# EAGLE board happyboardDIP2battery2 (EAGLE 5.06), part 1 of 2
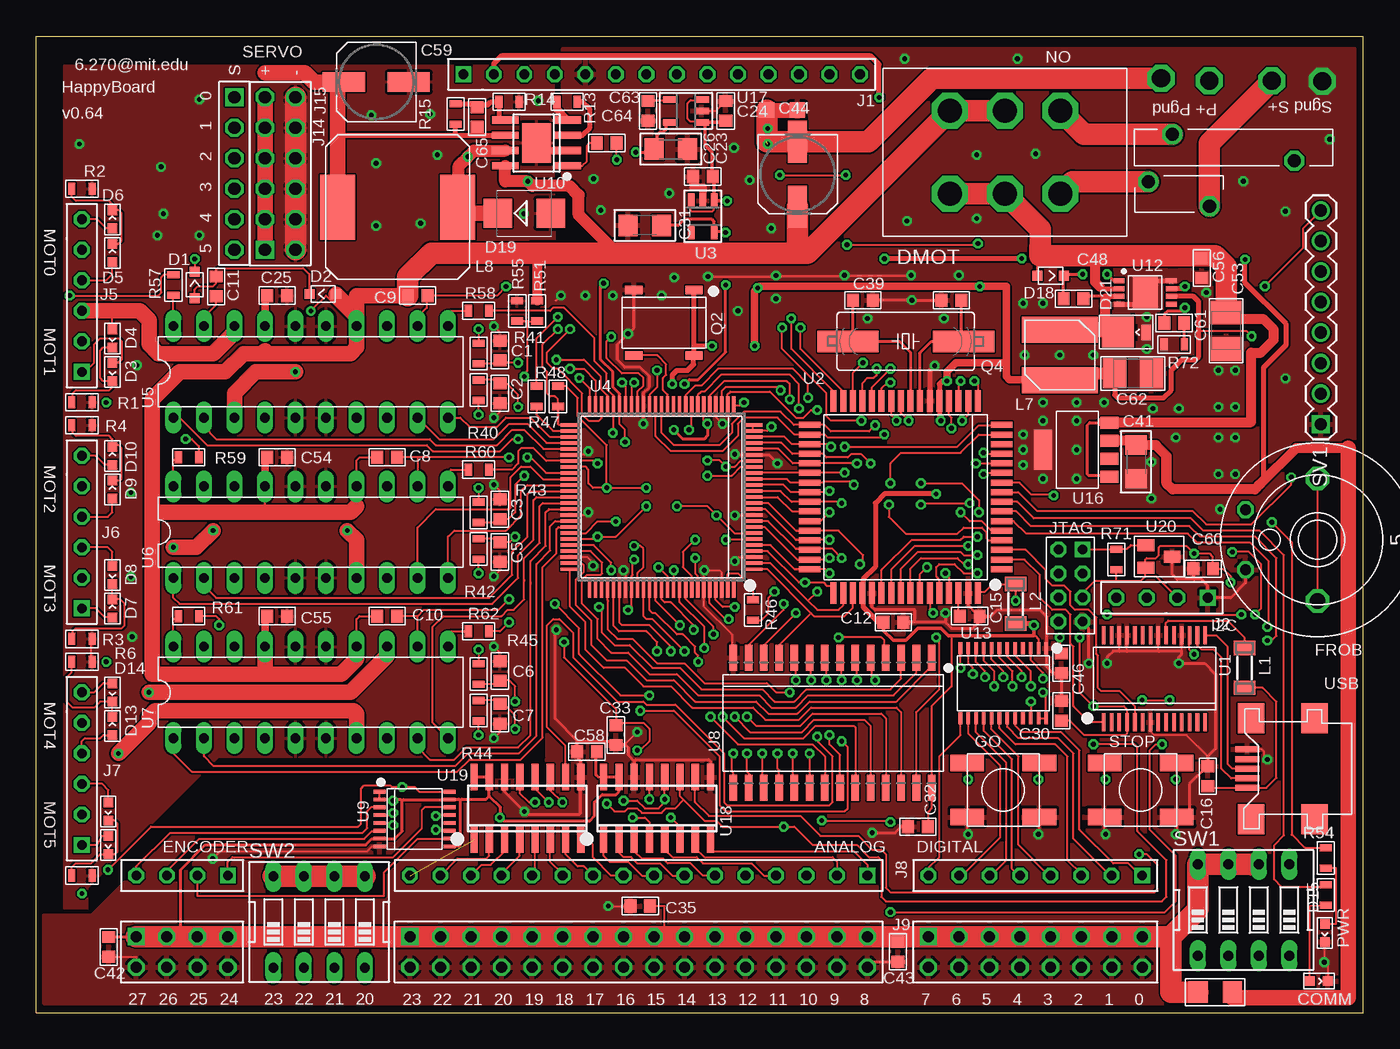
[diagram p6: board, top side]
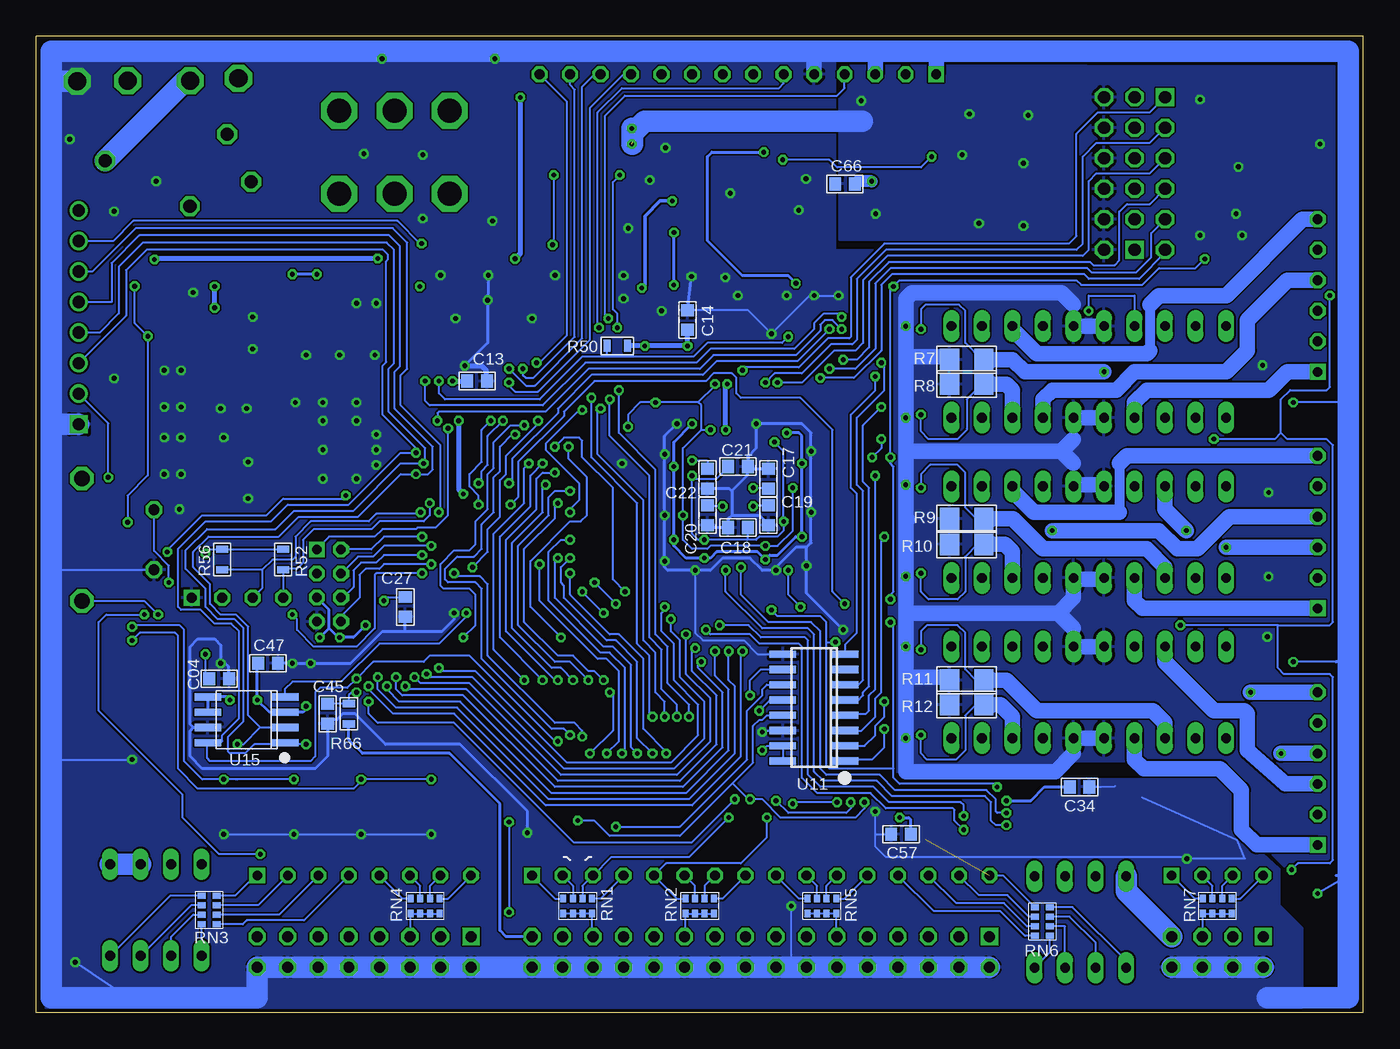
[diagram p7: board, bottom side, seen from below]

Size 110.49 x 81.28 mm. Coordinates in mm from the lower left corner, seen from the top.
Outline: 0,0 0,81.28 110.49,81.28 110.49,0 0,0
Copper layers (1*16): hide 0.035mm / dielectric 1.5mm / Bottom 0.035mm
Design rules "4pcb": minimum track width 6mil, minimum drill 15mil, track to track 6mil, track to pad 6mil, pad to pad 6mil, via to via 6mil, smd to smd 6mil, copper to edge 6mil, drill to drill 6mil, minimum pad ring 10mil, minimum via ring 8mil, stop-mask expansion 4mil, vias tented up to drill 0mil, thermal gap 10mil

## Footprints (pad centres in the part's own frame; a part is rotated, then mirrored left to right if it is on the bottom)
C0603 = smd 0.991 x 1.092: 1 -0.824,0; 2 0.824,0
C1206 = smd 1.6 x 1.8: 1 -1.4,0; 2 1.4,0
153CLV-0605 = smd 3.5 x 1.6: + 2.7,0; - -2.7,0
B/3528-21R = smd 1.95 x 2.5: + 1.525,0; - -1.525,0
SOD323 = smd 0.813 x 0.813: A 1.1,0; C -1.1,0
CHIP-LED0603 = smd 0.8 x 0.8: A 0,-0.75; C 0,0.75
SMB = smd 2.4 x 2.4: A 2.2,0; C -2.2,0
DO216 = smd 0.762 x 1.27: A 0.838,-0.025 | smd 2.667 x 2.54: C -1.524,0
FE14 = drill 0.813 square: 1 -17.78,0 | drill 0.813 octagon: 2 -15.24,0; 3 -12.7,0; 4 -10.16,0; 5 -7.62,0; 6 -5.08,0; 7 -2.54,0; 8 0,0; 9 2.54,0; 10 5.08,0; 11 7.62,0; 12 10.16,0; 13 12.7,0; 14 15.24,0
FE04-1 = drill 0.813 square: 1 -3.81,0 | drill 0.813 octagon: 2 -1.27,0; 3 1.27,0; 4 3.81,0
A3C-8DA = drill 0.8 square: 1 -3,1 | drill 0.8 octagon: 2 -3,-1; 3 -1,1; 4 -1,-1; 5 1,1; 6 1,-1; 7 3,1; 8 3,-1
FE06 = drill 0.813 square: 1 -6.35,0 | drill 0.813 octagon: 2 -3.81,0; 3 -1.27,0; 4 1.27,0; 5 3.81,0; 6 6.35,0
FE08 = drill 0.813 square: 1 -8.89,0 | drill 0.813 octagon: 2 -6.35,0; 3 -3.81,0; 4 -1.27,0; 5 1.27,0; 6 3.81,0; 7 6.35,0; 8 8.89,0
FE08-2 = drill 0.914 square: 1 -8.89,1.27 | drill 0.914 octagon: 2 -8.89,-1.27; 3 -6.35,1.27; 4 -6.35,-1.27; 5 -3.81,1.27; 6 -3.81,-1.27; 7 -1.27,1.27; 8 -1.27,-1.27; 9 1.27,1.27; 10 1.27,-1.27; 11 3.81,1.27; 12 3.81,-1.27; 13 6.35,1.27; 14 6.35,-1.27; 15 8.89,1.27; 16 8.89,-1.27
FE16-1 = drill 0.813 square: 1 -19.05,0 | drill 0.813 octagon: 2 -16.51,0; 3 -13.97,0; 4 -11.43,0; 5 -8.89,0; 6 -6.35,0; 7 -3.81,0; 8 -1.27,0; 9 1.27,0; 10 3.81,0; 11 6.35,0; 12 8.89,0; 13 11.43,0; 14 13.97,0; 15 16.51,0; 16 19.05,0
FE16-2 = drill 0.914 square: 1 -19.05,1.27 | drill 0.914 octagon: 2 -19.05,-1.27; 3 -16.51,1.27; 4 -16.51,-1.27; 5 -13.97,1.27; 6 -13.97,-1.27; 7 -11.43,1.27; 8 -11.43,-1.27; 9 -8.89,1.27; 10 -8.89,-1.27; 11 -6.35,1.27; 12 -6.35,-1.27; 13 -3.81,1.27; 14 -3.81,-1.27; 15 -1.27,1.27; 16 -1.27,-1.27; 17 1.27,1.27; 18 1.27,-1.27; 19 3.81,1.27; 20 3.81,-1.27; 21 6.35,1.27; 22 6.35,-1.27; 23 8.89,1.27; 24 8.89,-1.27; 25 11.43,1.27; 26 11.43,-1.27; 27 13.97,1.27; 28 13.97,-1.27; 29 16.51,1.27; 30 16.51,-1.27; 31 19.05,1.27; 32 19.05,-1.27
FE04-2 = drill 0.914 square: 1 -5.08,1.27 | drill 0.914 octagon: 2 -5.08,-1.27; 3 -2.54,1.27; 4 -2.54,-1.27; 5 0,1.27; 6 0,-1.27; 7 2.54,1.27; 8 2.54,-1.27
MA06-1 = drill 1.016 square: 1 -6.35,0 | drill 1.016 octagon: 2 -3.81,0; 3 -1.27,0; 4 1.27,0; 5 3.81,0; 6 6.35,0
MA06-2 = drill 1.016 octagon: 1 -6.35,-1.27; 3 -3.81,-1.27; 4 -3.81,1.27; 5 -1.27,-1.27; 6 -1.27,1.27; 7 1.27,-1.27; 8 1.27,1.27; 9 3.81,-1.27; 10 3.81,1.27; 11 6.35,-1.27; 12 6.35,1.27 | drill 1.016 square: 2 -6.35,1.27
UX60A-MB-5SY = smd 0.5 x 2: 1 -1.6,2.3; 2 -0.8,2.3; 3 0,2.3; 4 0.8,2.3; 5 1.6,2.3 | smd 2.5 x 2.2: C1 -4.2,2; C2 -4.2,-3.3; C3 4.2,-3.3; C4 4.2,2
SM-1206 = smd 1.2 x 1.8: 1 -1.65,0; 2 1.65,0
R1206 = smd 1.6 x 1.803: 1 -1.422,0; 2 1.422,0
CDRH5D18 = smd 2.15 x 6.3: P$1 2.1,0; P$2 -2.1,0
CDRH127 = smd 5.4 x 2.9: P$1 0,5; P$2 0,-5
CITIZEN-CRYSTAL = smd 1.422 x 0.711: 1 -2.81,-2.767; 2 2.19,-2.767; 3 2.19,2.687; 4 -2.81,2.687
SM49 = smd 5.08 x 1.778: 1 -4.826,0; 2 4.826,0
R0603 = smd 0.6 x 1: 1 -0.85,0; 2 0.85,0
0603-ARC = smd 0.5 x 0.65: 1 -1.2,-0.625; 2 -0.4,-0.625; 3 0.4,-0.625; 4 1.2,-0.625; 5 1.2,0.625; 6 0.4,0.625; 7 -0.4,0.625; 8 -1.2,0.625
TL3301 = smd 2.794 x 1.397: P$1 -3,-2.25; P$2 3,-2.25; P$3 3,2.25; P$4 -3,2.25
1X08 = drill 1.016 square: 1 0,0 | drill 1.016 round: 2 2.54,0; 3 5.08,0; 4 7.62,0; 5 10.16,0; 6 12.7,0; 7 15.24,0; 8 17.78,0
EDG-04 = drill 0.813 long: 1 -3.81,-3.81; 2 -1.27,-3.81; 3 1.27,-3.81; 4 3.81,-3.81; 5 3.81,3.81; 6 1.27,3.81; 7 -1.27,3.81; 8 -3.81,3.81
SSOP-28 = smd 0.3 x 1.5: 1 -4.225,-3.625; 2 -3.575,-3.625; 3 -2.925,-3.625; 4 -2.275,-3.625; 5 -1.625,-3.625; 6 -0.975,-3.625; 7 -0.325,-3.625; 8 0.325,-3.625; 9 0.975,-3.625; 10 1.625,-3.625; 11 2.275,-3.625; 12 2.925,-3.625; 13 3.575,-3.625; 14 4.225,-3.625; 15 4.225,3.625; 16 3.575,3.625; 17 2.925,3.625; 18 2.275,3.625; 19 1.625,3.625; 20 0.975,3.625; 21 0.325,3.625; 22 -0.325,3.625; 23 -0.975,3.625; 24 -1.625,3.625; 25 -2.275,3.625; 26 -2.925,3.625; 27 -3.575,3.625; 28 -4.225,3.625
TQFP64 = smd 0.5 x 1.8: 1 -6,-8; 2 -5.2,-8; 3 -4.4,-8; 4 -3.6,-8; 5 -2.8,-8; 6 -2,-8; 7 -1.2,-8; 8 -0.4,-8; 9 0.4,-8; 10 1.2,-8; 11 2,-8; 12 2.8,-8; 13 3.6,-8; 14 4.4,-8; 15 5.2,-8; 16 6,-8; 33 6,8; 34 5.2,8; 35 4.4,8; 36 3.6,8; 37 2.8,8; 38 2,8; 39 1.2,8; 40 0.4,8; 41 -0.4,8; 42 -1.2,8; 43 -2,8; 44 -2.8,8; 45 -3.6,8; 46 -4.4,8; 47 -5.2,8; 48 -6,8 | smd 1.8 x 0.5: 17 8,-6; 18 8,-5.2; 19 8,-4.4; 20 8,-3.6; 21 8,-2.8; 22 8,-2; 23 8,-1.2; 24 8,-0.4; 25 8,0.4; 26 8,1.2; 27 8,2; 28 8,2.8; 29 8,3.6; 30 8,4.4; 31 8,5.2; 32 8,6; 49 -8,6; 50 -8,5.2; 51 -8,4.4; 52 -8,3.6; 53 -8,2.8; 54 -8,2; 55 -8,1.2; 56 -8,0.4; 57 -8,-0.4; 58 -8,-1.2; 59 -8,-2; 60 -8,-2.8; 61 -8,-3.6; 62 -8,-4.4; 63 -8,-5.2; 64 -8,-6
SOT23-5 = smd 0.55 x 1.2: 1 -0.95,-1.3; 2 0,-1.3; 3 0.95,-1.3; 4 0.95,1.3; 5 -0.95,1.3
VQ100 = smd 0.27 x 1.6: 1 -6,-7.6; 2 -5.5,-7.6; 3 -5,-7.6; 4 -4.5,-7.6; 5 -4,-7.6; 6 -3.5,-7.6; 7 -3,-7.6; 8 -2.5,-7.6; 9 -2,-7.6; 10 -1.5,-7.6; 11 -1,-7.6; 12 -0.5,-7.6; 13 0,-7.6; 14 0.5,-7.6; 15 1,-7.6; 16 1.5,-7.6; 17 2,-7.6; 18 2.5,-7.6; 19 3,-7.6; 20 3.5,-7.6; 21 4,-7.6; 22 4.5,-7.6; 23 5,-7.6; 24 5.5,-7.6; 25 6,-7.6; 51 6,7.6; 52 5.5,7.6; 53 5,7.6; 54 4.5,7.6; 55 4,7.6; 56 3.5,7.6; 57 3,7.6; 58 2.5,7.6; 59 2,7.6; 60 1.5,7.6; 61 1,7.6; 62 0.5,7.6; 63 0,7.6; 64 -0.5,7.6; 65 -1,7.6; 66 -1.5,7.6; 67 -2,7.6; 68 -2.5,7.6; 69 -3,7.6; 70 -3.5,7.6; 71 -4,7.6; 72 -4.5,7.6; 73 -5,7.6; 74 -5.5,7.6; 75 -6,7.6 | smd 1.6 x 0.27: 26 7.6,-6; 27 7.6,-5.5; 28 7.6,-5; 29 7.6,-4.5; 30 7.6,-4; 31 7.6,-3.5; 32 7.6,-3; 33 7.6,-2.5; 34 7.6,-2; 35 7.6,-1.5; 36 7.6,-1; 37 7.6,-0.5; 38 7.6,0; 39 7.6,0.5; 40 7.6,1; 41 7.6,1.5; 42 7.6,2; 43 7.6,2.5; 44 7.6,3; 45 7.6,3.5; 46 7.6,4; 47 7.6,4.5; 48 7.6,5; 49 7.6,5.5; 50 7.6,6; 76 -7.6,6; 77 -7.6,5.5; 78 -7.6,5; 79 -7.6,4.5; 80 -7.6,4; 81 -7.6,3.5; 82 -7.6,3; 83 -7.6,2.5; 84 -7.6,2; 85 -7.6,1.5; 86 -7.6,1; 87 -7.6,0.5; 88 -7.6,0; 89 -7.6,-0.5; 90 -7.6,-1; 91 -7.6,-1.5; 92 -7.6,-2; 93 -7.6,-2.5; 94 -7.6,-3; 95 -7.6,-3.5; 96 -7.6,-4; 97 -7.6,-4.5; 98 -7.6,-5; 99 -7.6,-5.5; 100 -7.6,-6
DIL20 = drill 0.813 long: 1 -11.43,-3.81; 2 -8.89,-3.81; 3 -6.35,-3.81; 4 -3.81,-3.81; 5 -1.27,-3.81; 6 1.27,-3.81; 7 3.81,-3.81; 8 6.35,-3.81; 9 8.89,-3.81; 10 11.43,-3.81; 11 11.43,3.81; 12 8.89,3.81; 13 6.35,3.81; 14 3.81,3.81; 15 1.27,3.81; 16 -1.27,3.81; 17 -3.81,3.81; 18 -6.35,3.81; 19 -8.89,3.81; 20 -11.43,3.81
SOJ28-4 = smd 0.635 x 2.159: 1 -8.255,-5.41; 2 -6.985,-5.41; 3 -5.715,-5.41; 4 -4.445,-5.41; 5 -3.175,-5.41; 6 -1.905,-5.41; 7 -0.635,-5.41; 8 0.635,-5.41; 9 1.905,-5.41; 10 3.175,-5.41; 11 4.445,-5.41; 12 5.715,-5.41; 13 6.985,-5.41; 14 8.255,-5.41; 15 8.255,5.41; 16 6.985,5.41; 17 5.715,5.41; 18 4.445,5.41; 19 3.175,5.41; 20 1.905,5.41; 21 0.635,5.41; 22 -0.635,5.41; 23 -1.905,5.41; 24 -3.175,5.41; 25 -4.445,5.41; 26 -5.715,5.41; 27 -6.985,5.41; 28 -8.255,5.41
TSSOP16 = smd 0.305 x 0.991: 1 -2.275,-2.918; 2 -1.625,-2.918; 3 -0.975,-2.918; 4 -0.325,-2.918; 5 0.325,-2.918; 6 0.975,-2.918; 7 1.625,-2.918; 8 2.275,-2.918; 9 2.275,2.918; 10 1.625,2.918; 11 0.975,2.918; 12 0.325,2.918; 13 -0.325,2.918; 14 -0.975,2.918; 15 -1.625,2.918; 16 -2.275,2.918
SO-08-PAD = smd 0.6 x 2.2: 1 -1.905,-2.6; 2 -0.635,-2.6; 3 0.635,-2.6; 4 1.905,-2.6; 5 1.905,2.6; 6 0.635,2.6; 7 -0.635,2.6; 8 -1.905,2.6 | smd 3.277 x 2.388: P$1 0,0
SO16 = smd 0.6 x 2.2: 1 -4.445,-2.6; 2 -3.175,-2.6; 3 -1.905,-2.6; 4 -0.635,-2.6; 5 0.635,-2.6; 6 1.905,-2.6; 7 3.175,-2.6; 8 4.445,-2.6; 9 4.445,2.6; 10 3.175,2.6; 11 1.905,2.6; 12 0.635,2.6; 13 -0.635,2.6; 14 -1.905,2.6; 15 -3.175,2.6; 16 -4.445,2.6
MSOP8E = smd 0.42 x 0.89: 1 -0.975,-2.177; 2 -0.325,-2.177; 3 0.325,-2.177; 4 0.975,-2.177; 5 0.975,2.177; 6 0.325,2.177; 7 -0.325,2.177; 8 -0.975,2.177 | smd 2.8 x 2.1: PAD 0,0
TSSOP24 = smd 0.305 x 0.991: 1 -3.575,-2.918; 2 -2.925,-2.918; 3 -2.275,-2.918; 4 -1.625,-2.918; 5 -0.975,-2.918; 6 -0.325,-2.918; 7 0.325,-2.918; 8 0.975,-2.918; 9 1.625,-2.918; 10 2.275,-2.918; 11 2.925,-2.918; 12 3.575,-2.918; 13 3.575,2.918; 14 2.925,2.918; 15 2.275,2.918; 16 1.625,2.918; 17 0.975,2.918; 18 0.325,2.918; 19 -0.325,2.918; 20 -0.975,2.918; 21 -1.625,2.918; 22 -2.275,2.918; 23 -2.925,2.918; 24 -3.575,2.918
SO8 = smd 0.6 x 2.2: 1 -1.905,-3.235; 2 -0.635,-3.235; 3 0.635,-3.235; 4 1.905,-3.235; 5 1.905,3.235; 6 0.635,3.235; 7 -0.635,3.235; 8 -1.905,3.235
SOT223-5 = smd 3.3 x 1.5: 1 0,3.454 | smd 1 x 1.5: 2 -2.25,-2.1; 3 -0.75,-2.1; 4 0.75,-2.1; 5 2.25,-2.1
SOT23 = smd 1 x 1.4: 1 -0.95,-1.1; 2 0.95,-1.1; 3 0,1.1
L202021MA04Q = drill 2 octagon: P$1 3.454,4.597; P$2 3.454,0; P$3 3.454,-4.597; P$4 -3.454,4.597; P$5 -3.454,0; P$6 -3.454,-4.597
RUEF090 = drill 1.1 octagon: P$1 -2.54,1.016; P$2 2.54,-1.016
RUEF600 = drill 1.1 octagon: P$2 -5.08,1.105; P$3 5.08,-1.105
FROBKNOB = drill 0.9 octagon: 1 -2.5,-6; 3 2.5,-6 | drill 1.3 octagon: 2A -5.1,0; 2B 5.1,0
GND-GNDA-1,27MM = smd 1.27 x 1.27: GND -1.27,0; GNDA 1.27,0

## Placement (x,y rotation side)
C1  1uF  [C0603]  38.61,55.12 90 top
C2  1uF  [C0603]  38.61,51.56 270 top
C3  1uF  [C0603]  38.61,41.91 90 top
C4  0.1uF  [C0603]  95.25,27.81 0 bottom
C5  1uF  [C0603]  38.61,38.35 270 top
C6  1uF  [C0603]  38.61,28.45 90 top
C7  1uF  [C0603]  38.61,24.89 270 top
C8  0.1uF  [C0603]  29.21,46.23 180 top
C9  0.1uF  [C0603]  31.75,59.69 180 top
C10  0.1uF  [C0603]  29.21,33.02 180 top
C11  33nF  [C0603]  14.99,60.45 270 top
C12  0.1uF  [C0603]  71.37,32.51 0 top
C13  0.1uF  [C0603]  73.79,52.58 0 bottom
C14  0.1uF  [C0603]  56.26,57.66 90 bottom
C15  0.1uF  [C0603]  77.72,33.02 0 top
C16  10nF  [C0603]  97.54,19.68 90 top
C17  0.1uF  [C0603]  49.53,44.45 90 bottom
C18  0.1uF  [C0603]  52.07,40.39 180 bottom
C19  0.1uF  [C0603]  49.53,41.4 270 bottom
C20  0.1uF  [C0603]  54.61,41.4 270 bottom
C21  0.1uF  [C0603]  52.07,45.47 0 bottom
C22  0.1uF  [C0603]  54.61,44.45 270 bottom
C23  0.1uF  [C0603]  55.5,69.6 180 top
C24  0.1uF  [C0603]  57.4,75.06 90 top
C25  0.1uF  [C0603]  20.07,59.69 180 top
C26  2.2uF  [C1206]  52.83,71.88 0 top
C27  0.1uF  [C0603]  79.76,33.78 270 bottom
C30  0.1uF  [C0603]  85.34,25.15 90 top
C31  10uF  [C1206]  50.67,65.53 180 top
C32  0.1uF  [C0603]  73.41,15.49 180 top
C33  0.1uF  [C0603]  48.26,23.11 270 top
C34  0.1uF  [C0603]  23.62,18.8 0 bottom
C35  10nF  [C0603]  50.29,8.89 180 top
C39  18pF  [C0603]  68.83,59.31 0 top
C40  18pF  [C0603]  76.2,59.31 180 top
C41  10uF  [C1206]  91.57,45.85 270 top
C42  0.1uF  [C0603]  6.05,5.49 270 top
C43  0.1uF  [C0603]  71.75,5.08 270 top
C44  220uF  [153CLV-0605]  63.39,69.78 270 top
C45  0.1uF  [C0603]  86.23,24.89 270 bottom
C46  0.1uF  [C0603]  85.34,29.08 270 top
C47  0.1uF  [C0603]  91.19,29.08 0 bottom
C48  0.1uF  [C0603]  86.36,59.44 180 top
C53  10uF  [B/3528-21R]  99.06,56.77 90 top
C54  0.1uF  [C0603]  20.07,46.23 180 top
C55  0.1uF  [C0603]  20.07,33.02 180 top
C56  1uF  [C0603]  97.03,61.98 270 top
C57  0.1uF  [C0603]  38.48,14.86 180 bottom
C58  0.1uF  [C0603]  45.85,21.72 180 top
C59  220uF  [153CLV-0605]  28.32,77.47 180 top
C60  0.1uF  [C0603]  97.16,36.96 180 top
C61  1.5nF  [C0603]  94.74,57.4 0 top
C62  10uF  [B/3528-21R]  91.31,53.21 180 top
C63  1.5nF  [C0603]  50.93,75.06 270 top
C64  10nF  [C0603]  47.5,72.39 0 top
C65  0.22uF  [C0603]  36.7,74.55 90 top
C66  0.22uF  [C0603]  43.15,68.98 180 bottom
D1  1N4148  [SOD323]  13.21,60.58 270 top
D2  1N4148  [SOD323]  23.88,59.82 0 top
D3  GRN  [CHIP-LED0603]  6.35,53.34 180 top
D4  RED  [CHIP-LED0603]  6.35,56.13 180 top
D5  GRN  [CHIP-LED0603]  6.35,63.25 0 top
D6  RED  [CHIP-LED0603]  6.35,66.04 0 top
D7  GRN  [CHIP-LED0603]  6.35,33.66 0 top
D8  RED  [CHIP-LED0603]  6.35,36.45 180 top
D9  GRN  [CHIP-LED0603]  6.35,43.56 0 top
D10  RED  [CHIP-LED0603]  6.35,46.35 0 top
D11  GRN  [CHIP-LED0603]  6.01,13.97 180 top
D12  RED  [CHIP-LED0603]  6.01,16.76 180 top
D13  GRN  [CHIP-LED0603]  6.35,23.88 0 top
D14  RED  [CHIP-LED0603]  6.35,26.67 180 top
D15  GRN  [CHIP-LED0603]  107.28,6.66 180 top
D16  RED  [CHIP-LED0603]  106.78,2.65 270 top
D18  BAT54WS  [SOD323]  84.45,61.34 180 top
D19  SSB44  [SMB]  40.64,66.55 0 top
D21  UPS120  [DO216]  91.57,56.64 0 top
DISP1  16X2LCD  [16X2LCD]  70.36,63.12 180 top
J1  14 Pin Female Header  [FE14]  53.34,78.11 0 top
J2  4 Pin Female Header  [FE04-1]  93.73,34.54 180 top
J4  A3C-8DA  [A3C-8DA]  86.11,35.56 270 top
J5  6x1 Pin Female Header  [FE06]  3.81,59.69 90 top
J6  6x1 Pin Female Header  [FE06]  3.81,40.01 90 top
J7  6x1 Pin Female Header  [FE06]  3.81,20.32 90 top
J8  8x1 Pin Female Header  [FE08]  83.19,11.43 180 top
J9  8x2 Pin Female Header  [FE08-2]  83.19,5.08 0 top
J10  16x1 Pin Female Header  [FE16-1]  50.16,11.43 180 top
J11  16x2 Pin Female Header  [FE16-2]  50.16,5.08 0 top
J12  4x1 Pin Female Header  [FE04-1]  12.15,11.43 180 top
J13  4x2 Pin Female Header  [FE04-2]  13.43,5.08 0 top
J14  6x1 Pin Male Header  [MA06-1]  16.51,69.85 270 top
J15  6x2 Pin Male Header  [MA06-2]  20.32,69.85 90 top
J16  MINIUSB  [UX60A-MB-5SY]  103.12,20.32 90 top
L1  31  [SM-1206]  100.58,28.7 90 top
L2  10uH  [SM-1206]  81.53,34.04 90 top
L3  1uH  [R1206]  98.15,1.72 180 top
L7  5uH  [CDRH5D18]  85.22,54.74 90 top
L8  CDRH127 68uH  [CDRH127]  30.1,67.06 270 top
Q2  8MHz  [CITIZEN-CRYSTAL]  51.94,57.4 180 top
Q4  8MHz  [SM49]  72.39,55.88 180 top
R1  1K  [R0603]  3.81,50.8 180 top
R2  1K  [R0603]  3.81,68.58 180 top
R3  1K  [R0603]  3.81,31.11 180 top
R4  1K  [R0603]  3.81,48.9 180 top
R5  1K  [R0603]  3.81,11.43 180 top
R6  1K  [R0603]  3.81,29.21 180 top
R7  0.2  [R1206]  33.02,54.36 0 bottom
R8  0.2  [R1206]  33.02,52.32 0 bottom
R9  0.2  [R1206]  33.02,41.12 0 bottom
R10  0.2  [R1206]  33.02,38.99 0 bottom
R11  0.2  [R1206]  33.02,27.69 0 bottom
R12  0.2  [R1206]  33.02,25.65 0 bottom
R13  7.68K  [R0603]  44.2,75.82 0 top
R14  1.2K  [R0603]  39.37,75.82 180 top
R15  6.3K  [R0603]  34.92,74.8 90 top
R40  3K  [R0603]  36.83,51.82 270 top
R41  3K  [R0603]  36.83,54.86 90 top
R42  3K  [R0603]  36.83,38.61 270 top
R43  3K  [R0603]  36.83,41.66 90 top
R44  3K  [R0603]  36.83,25.15 270 top
R45  3K  [R0603]  36.83,28.19 90 top
R46  56  [R0603]  59.69,33.53 90 top
R47  56  [R0603]  41.66,51.31 270 top
R48  330  [R0603]  43.43,51.31 90 top
R50  4.7K  [R0603]  62.1,55.5 180 bottom
R51  10K  [R0603]  41.7,58.42 270 top
R52  10K  [R0603]  89.92,37.72 90 bottom
R53  560  [R0603]  107.35,9.8 90 top
R54  560  [R0603]  107.37,12.89 90 top
R55  4.7K  [R0603]  40.06,58.42 90 top
R56  10K  [R0603]  95,37.72 90 bottom
R57  47K  [R0603]  11.43,60.58 270 top
R58  47K  [R0603]  36.83,58.42 180 top
R59  47K  [R0603]  12.7,46.23 180 top
R60  47K  [R0603]  36.83,45.21 180 top
R61  47K  [R0603]  12.7,33.02 180 top
R62  47K  [R0603]  36.83,31.75 180 top
R66  200K  [R0603]  84.45,24.89 270 bottom
R71  10K  [R0603]  89.92,37.72 90 top
R72  4.7K  [R0603]  94.74,55.63 180 top
RN1  47K  [0603-ARC]  65.41,8.89 0 bottom
RN2  47K  [0603-ARC]  55.24,8.89 0 bottom
RN3  47K  [0603-ARC]  96.08,8.56 270 bottom
RN4  47K  [0603-ARC]  78.11,8.89 0 bottom
RN5  47K  [0603-ARC]  45.09,8.89 0 bottom
RN6  47K  [0603-ARC]  26.72,7.61 90 bottom
RN7  47K  [0603-ARC]  12.15,8.89 0 bottom
S2  tact  [TL3301]  80.52,18.54 0 top
S3  tact  [TL3301]  91.95,18.54 0 top
SV1  [1X08]  106.95,48.99 90 top
SW1  [EDG-04]  100.52,8.56 0 top
SW2  [EDG-04]  23.56,7.56 0 top
U1  FT232RL  [SSOP-28]  93.09,27.81 0 top
U2  ATMEGA128L  [TQFP64]  72.39,42.93 90 top
U3  PQ1T251M2ZP  [SOT23-5]  55.5,66.29 180 top
U4  XC3S50  [VQ100]  52.07,42.93 90 top
U5  L6205N  [DIL20]  22.86,53.34 0 top
U6  L6205N  [DIL20]  22.86,40.01 0 top
U7  L6205N  [DIL20]  22.86,26.67 0 top
U8  CY7C199  [SOJ28-4]  66.29,24.13 180 top
U9  CD40109B  [TSSOP16]  31.5,16.13 270 top
U10  A8447  [SO-08-PAD]  41.66,72.39 90 top
U11  MCP3008  [SO16]  45.72,25.4 90 bottom
U12  LT1767EMS8E  [MSOP8E]  92.33,59.94 270 top
U13  GTL2010PW  [TSSOP24]  80.52,27.43 180 top
U15  AT45DB011B  [SO8]  92.96,24.38 90 bottom
U16  LP36890  [SOT223-5]  87.25,46.86 90 top
U17  ADP171X  [SOT23-5]  54.1,75.06 90 top
U18  MCP3008  [SO16]  51.69,17.02 0 top
U19  MCP3008  [SO16]  40.89,17.02 0 top
U20  MCP130T  [SOT23]  93.47,37.97 270 top
U$10  L202021MA04Q  [L202021MA04Q]  80.66,71.61 270 top
U$11  RUEF090  [RUEF090]  95.14,68.15 180 top
U$16  RUEF600  [RUEF600]  99.67,72.01 180 top
VR1  FROBKNOB  [FROBKNOB]  106.68,39.37 270 top
~NUDEV~1  GND-GNDA1,27MM  [GND-GNDA-1,27MM]  62.1,75.13 180 top

## Tracks (layer width: path | path; a pad name or v marks a point on that pad's centre or on a via)
+1.2V  (via drill 0.4)
  hide 0.152: U4.69 45.77,39.93 46.74,40.89 v48.26,40.89 | U4.18 58.63,45.43 57.91,44.7 v55.88,44.7 | U4.45 48.57,48.97 49.02,48.51 v49.02,47.5 | v54.86,39.37 53.85,38.35 53.85,37.08 54.57,36.36 U4.93
  hide 0.254: U4.45 48.57,51.51 48.01,52.07 48.01,53.34 46.99,54.36 46.99,60.45 v47.24,60.71 | 51.53,71.98 C26.1 | 51.56,71.88 51.31,71.63 v49.91,71.63
  hide 0.305: C26.1 51.56,71.88 51.53,71.91 51.69,72.14 51.69,73.03 51.94,73.28 52.2,73.28 52.45,73.53 52.45,74.04 U17.5
  Bottom 0.152: 51.31,39.37 50.55,39.37 50.29,39.62 48.77,39.62 48.26,40.13 v48.26,40.89 48.26,46.74 v49.02,47.5 | 51.31,39.37 v54.86,39.37 55.37,39.37 55.88,39.88 55.88,44.45 | 55.88,44.45 53.85,44.45 52.83,45.47 C21.1 | C18.1 51.25,39.43 51.31,39.37 | 55.88,44.45 v55.88,44.7
  Bottom 0.254: v47.24,60.71 47.88,61.34 51.69,61.34 54.61,64.26 54.61,71.25 54.23,71.63 v49.91,71.63
+2.5V  (via drill 0.4)
  hide 0.152: 59.69,48.93 U4.25 59.67,48.53 59.69,48.51 59.67,48.49 U4.24 60.87,48.43 v61.21,48.77 | U4.26 58.65,50.53 v58.93,50.8 | U4.58 45.76,45.43 45.97,45.21 45.97,44.07 46.35,43.69 v47.5,43.69 | U4.33 54.57,48.73 v54.36,48.51 | U4.7 58.12,39.93 v56.64,41.4 55.88,42.16 v53.34,42.16 | U4.84 50.07,36.61 50.55,37.08 50.55,38.61 50.29,38.86 v49.78,38.86 | v47.5,43.69 v50.8,43.69 | R48.2 44.11,52.16 45.09,51.18 45.09,49.66 47.5,47.24 v47.5,43.69
  hide 0.254: v53.98,52.32 54.36,52.7 55.12,52.7 57.4,54.99 v57.4,60.58 | C31.1 53.47,65.53 53.98,66.04 56.26,66.04 56.45,65.85 U3.5 57.33,64.99 v57.39,64.93
  Bottom 0.152: v61.21,48.77 61.21,49.78 60.2,50.8 v58.93,50.8 55.37,50.8 | 55.12,48.51 v54.36,48.51 | v47.5,43.69 47.5,40.13 48.77,38.86 v49.78,38.86 54.36,38.86 54.61,38.61 55.88,38.61 56.64,39.37 v56.64,41.4 56.64,46.99 55.12,48.51 | 55.12,48.51 55.12,50.55 55.37,50.8 | C17.1 49.53,43.69 v50.8,43.69 | C20.1 54.61,42.16 v53.34,42.16 | 55.37,50.8 53.98,52.2 v53.98,52.32
  Bottom 0.254: v57.4,60.58 v57.39,64.93
+3.3V  (via drill 0.4)
  hide 0.152: v2.79,59.69 10.16,59.69 10.41,59.94 10.41,61.21 10.67,61.47 11.3,61.47 11.34,61.43 R57.1 | v15.24,32.26 15.24,32.77 14.99,33.02 R61.1 | R59.1 13.55,47.16 12.95,47.75 v12.45,47.75 | v46.74,45.72 46.53,45.93 U4.57 42.47,45.93 41.4,46.99 40.39,46.99 40.13,46.74 40.13,45.72 39.62,45.21 R60.1 37.59,45.21 | U4.70 46.43,39.43 v46.74,39.62 48.26,39.62 v50.8,42.16 | U4.94 55.07,36.37 54.86,36.58 v54.86,37.85 | U4.6 57.46,39.43 v57.4,39.37 | U4.19 58.63,45.93 58.17,45.47 v57.4,45.47 56.9,45.97 v55.88,45.97 | v48.01,48.26 48.07,48.32 U4.46 48.07,51.37 47.5,51.94 47.5,53.21 46.48,54.23 46.48,56.13 43.94,58.67 43.05,58.67 42.8,58.42 R58.1 | 68.83,34.8 68.79,34.84 U2.52 68.79,35.01 68.83,35.05 | R62.1 38.61,31.75 v39.37,32.51 | v49.28,33.53 49.57,33.82 U4.83 49.57,36.36 49.66,36.45 49.66,37.59 v49.78,37.72 | U4.31 55.57,49.33 v55.88,49.02 | v83.06,32.26 82.93,32.39 | 75.95,31.37 76.07,31.37 76.2,31.24 76.2,27.18 74.55,25.53 U8.28 74.55,17.02 74.23,16.7 C32.1 | U13.2 83.44,31.11 83.19,31.37 83.06,31.37 | 70.1,32.51 C12.1 | v50.04,21.84 50.29,21.84 51.05,22.61 51.05,23.62 50.55,24.13 48.26,24.13 | 48.26,24.13 C33.1 | 48.26,24.13 48.26,25.27 43.94,29.59 v43.94,30.86 | U9.16 34.41,18.41 34.42,18.41 31.88,18.41 31.5,18.8 v30.48,18.8 29.59,18.8 29.46,18.92 27.3,18.92 27.05,18.67 27.05,15.75 26.8,15.49 9.57,15.49 v5.98,11.91 | J4.5 87.11,34.91 88.14,35.94 89.92,35.94 | 89.92,35.94 91.95,35.94 92.33,36.32 | 89.92,35.94 R71.1 | v92.08,26.04 v94.36,26.04 | v86.87,31.24 86.87,26.67 v88.01,25.53 90.55,25.53 90.82,25.26 U1.4 90.82,24.14 90.81,24.13 90.81,23.24 90.68,23.11 87.25,23.11 86.04,24.32 C30.1
  hide 0.152: v85.22,31.24 85.22,29.97 C46.1 | 92.33,36.32 92.33,36.83 | 92.33,36.83 92.33,36.96 92.37,37 U20.2 92.37,36.87 92.33,36.83 | 54.74,54.61 54.75,54.63 Q2.4 54.74,54.74 54.86,54.74 54.84,54.72 | Q2.1 54.75,60.18 54.74,60.2 | v75.82,52.58 75.44,52.58 | 92.33,36.83 92.33,37.72 92.46,37.85 93.22,37.85 93.47,38.1 93.47,38.73 93.6,38.86 95.76,38.86 v96.39,38.23 97.66,38.23 97.92,37.97 97.92,37.08 97.98,37.02 C60.1 | 55.37,74.17 54.48,74.17 54.23,74.42 54.23,75.69 54.48,75.95 55.5,75.95 | 55.44,76.01 U17.3 | U3.3 54.48,67.72 54.48,66.8 54.61,66.67 56.26,66.67 56.39,66.8 56.39,67.72 U3.1 | v99.44,35.81 99.44,36.32 98.81,36.96 C60.1 | C60.1 97.92,36.96 | 92.33,36.32 93.22,36.32 J2.2 | 104.52,14.85 104.52,14.81 | R54.2 105.63,13.74 104.52,14.85 | 104.52,14.85 104.52,39.16 v102.86,40.82 | 96.77,56.75 100.75,56.75 v101.19,56.31 | v102.28,60.46 105.47,63.65 105.47,65.29 SV1.8
  hide 0.254: v55.88,49.02 55.88,48.01 55.63,47.75 53.85,47.75 v53.09,48.51 | 57.4,73.91 57.34,74.11 57.4,74.17
  hide 0.305: C12.1 70.55,31.81 71.37,30.99 72.39,30.99 73.41,32 75.31,32 75.95,31.37 83.06,31.37 v83.06,32.26 | 55.4,74.14 55.37,74.17 | 55.4,74.14 U17.1 55.4,74.04 55.69,74.04 55.69,72.2 56.26,71.63 56.26,69.72 | 57.34,74.11 55.43,74.11 55.4,74.14 | 55.5,75.95 55.44,76.01 | 57.4,74.17 C24.1 | v57.53,67.56 57.5,67.59 U3.1 56.45,69.53 56.26,69.72 | 56.26,69.72 56.32,69.66 C23.1
  hide 0.406: 68.83,34.8 68.83,33.78 70.1,32.51 | 82.93,32.39 L2.1 | 68.83,35.05 68.83,36.07 69.85,37.08 69.85,42.42 70.61,43.18 v74.93,43.18 | v52.96,52.32 52.96,53.09 53.34,53.47 54.23,53.47 54.74,53.98 54.74,54.61 | Q2.4 54.75,55.5 | 54.75,55.5 54.75,60.18 | 75.44,52.58 75.19,52.33 U2.21 75.19,49.4 v75.31,49.28 | 54.75,55.5 v56.26,55.5 | v60.07,60.33 60.2,60.45 | U12.6 96.34,59.62 96.77,59.18 96.77,56.75 96.77,54.61 96.52,54.36 95.38,54.36 94.49,53.47 94.49,51.82 93.85,51.18 90.04,51.18 89.79,51.44 C62.+ | 85.22,52.7 L7.P$2 85.22,52.45 | v78.55,60.45
  hide 0.61: v59.82,55.5 59.82,60.07 v60.07,60.33 | 60.2,60.45 v78.55,60.45 80.77,60.45 80.77,54.1 | 80.77,54.1 76.58,54.1 75.82,53.34 v75.82,52.58 | 80.77,54.1 80.77,52.96 81.03,52.7 84.96,52.7 85.09,52.58 85.15,52.64 L7.P$2
  hide 1.016: C62.+ 85.72,53.21 85.22,52.7
  Bottom 0.152: v2.79,59.69 2.79,52.07 3.05,51.82 6.1,51.82 6.86,51.05 6.86,48.26 | 6.86,48.26 6.35,47.75 3.05,47.75 2.54,47.24 2.54,32.51 2.79,32.26 7.11,32.26 | v12.45,47.75 7.37,47.75 6.86,48.26 | 7.11,32.26 v15.24,32.26 | 7.11,32.26 7.11,28.7 6.6,28.19 2.79,28.19 2.54,27.94 2.54,12.7 2.79,12.45 5.45,12.45 v5.98,11.91 | C19.1 50.74,42.23 v50.8,42.16 | v49.28,33.53 48.77,33.02 45.21,33.02 44.7,32.51 44.7,30.86 | C22.1 54.61,45.97 v55.88,45.97 | U11.16 48.32,22.04 48.26,22.1 48.32,22.16 U11.15 49.66,22.23 v50.04,21.84 | 39.12,20.32 39.12,32.26 v39.37,32.51 | 44.7,30.86 44.7,20.57 44.45,20.32 39.12,20.32 | 44.7,30.86 v43.94,30.86 | 39.12,20.32 39.12,19.56 38.61,19.05 30.73,19.05 v30.48,18.8 | 96.2,26.23 96.14,26.29 U15.5 | 87.11,34.53 J4.5 | R52.2 89.92,38.61 89.95,38.57 R56.2 96.05,38.57 v96.39,38.23 | v85.22,31.24 85.34,31.24 | 61.21,55.37 61.25,55.41 R50.1 | v99.44,35.81 99.44,37.21 100.68,38.45 VR1.1 | 92.08,29.08 C47.1 | v102.86,40.82 v102.87,40.83 102.87,43.04 101.19,44.72 v101.19,56.31 102.28,57.4 v102.28,60.46
  Bottom 0.254: v55.88,49.02 57.4,47.5 v57.4,45.47 v57.4,39.37 57.4,38.86 56.39,37.85 v54.86,37.85 54.36,37.85 53.85,38.35 50.42,38.35 v49.78,37.72 49.4,38.1 48.77,38.1 47.24,39.62 v46.74,39.62 v46.74,45.72 46.74,48.01 46.99,48.26 v48.01,48.26 | 96.2,26.23 U15.6 | 96.14,26.29 94.61,26.29 v94.36,26.04 | 85.34,31.24 86.11,32 | 86.11,32 86.11,33.53 87.11,34.53 | v88.01,25.53 88.01,25.27 88.27,25.02 U15.3 91.06,25.02 v92.08,26.04 92.08,29.08 | 86.11,32 v86.87,31.24 | v85.22,31.24 84.07,31.24 v83.06,32.26
  Bottom 0.305: v57.53,67.56 58.55,67.56 59.82,66.29 59.82,60.58 v60.07,60.33
  Bottom 0.406: v53.09,48.51 53.09,52.2 v52.96,52.32 | v75.82,52.58 C13.1 | v75.31,49.28 75.31,43.56 v74.93,43.18 | 56.26,56.9 C14.1 v56.26,55.5 v59.82,55.5 R50.1
+5.0V  (via drill 0.4)
  hide 0.152: 52.32,6.35 52.32,8.89 C35.1 | 28.45,14.48 28.47,14.5 U9.7 28.58,14.48 28.57,14.48 | 28.58,18.41 U9.1 | 28.58,18.41 U9.2 29.62,17.75 v29.72,17.65 29.82,17.75 | 28.58,18.41 28.57,18.41 | 34.42,17.78 34.41,17.78 U9.15 | U19.16 36.45,19.56 36.51,19.62 | 47.3,19.62 47.24,19.56 U18.16 46.8,19.62 | 46.61,21.72 C58.1
  hide 0.254: 12.03,6.35 12.05,11.93 14.09,13.97 15.96,13.97 | 15.96,13.97 15.72,13.97 | 15.96,13.97 27.43,13.97 27.94,14.48 28.45,14.48 | 30.48,17.65 30.38,17.75 29.82,17.75 | 30.48,17.65 30.48,15.11 29.84,14.48 28.57,14.48 | U9.15 30.58,17.75 30.48,17.65 | U9.9 35.19,13.85 35.31,13.97 35.31,17.65 | 35.31,17.65 35.18,17.78 34.42,17.78 | 35.31,17.65 35.43,17.78 37.47,17.78 37.72,18.03 | 37.72,18.03 U19.15 36.51,19.62 | 47.3,19.62 U18.15 48.51,18.41 48.26,18.16 47.12,18.16 46.48,17.53 46.48,16.38 46.1,16 38.86,16 v38.61,16.26 38.61,17.14 37.72,18.03 | 46.8,19.62 46.61,19.81 46.61,21.72 | C42.1 28.57,6.35 | 71.75,6.48 71.75,6.35 C43.1
  hide 1.27: 101.2,12.34 101.76,12.34 SW1.6
  hide 1.778: J13.1 J13.3 12.03,6.35 J13.5 J13.7 28.57,6.35 J11.1 J11.3 J11.5 39.37,6.35 | 44.45,6.35 J11.13 J11.15 J11.17 52.32,6.35 J11.19 J11.21 J11.23 J11.25 J11.27 J11.29 J11.31 71.75,6.35 J9.1 J9.3 J9.5 J9.7 J9.9 J9.11 J9.13 J9.15 94.47,6.35 | 44.45,6.35 J11.11 | 44.45,6.35 J11.9 39.37,6.35 | 39.37,6.35 J11.7 | 101.2,12.34 101.17,12.37 SW1.7 SW1.8 96.71,8.59 94.47,6.35 | L3.2 94.47,1.72 94.47,6.35 | SW2.8 SW2.7 SW2.6 SW2.5
  Bottom 0.152: 37.72,14.99 37.66,14.92 C57.1 | J9.5 79.31,6.42 79.31,8.2 79.25,8.26 | J9.11 87.06,6.42 | RN4.3 RN4.4 | RN4.3 77.71,8.27 77.72,8.26 | RN4.3 78.48,8.27 78.49,8.26 78.5,8.27 RN4.2 79.24,8.27 79.25,8.26 | 79.25,8.26 79.26,8.27 RN4.1 | J11.27 64.2,6.42 RN1.4 64.25,8.27 64.26,8.26 64.27,8.27 RN1.3 | J11.21 56.45,6.42 RN2.1 56.4,8.27 56.39,8.26 56.38,8.27 RN2.2 55.63,8.26 55.62,8.27 RN2.3 | J11.5 36.12,6.42 | J11.11 43.88,6.42 RN5.4 43.93,8.27 43.94,8.26 43.95,8.27 RN5.3 44.7,8.26 44.71,8.27 RN5.2 | RN5.2 45.47,8.26 | RN5.2 RN5.1 | J13.5 13.36,6.42 RN7.1 13.41,8.27 | RN7.3 RN7.4 | RN7.3 11.76,8.27 11.77,8.26 | RN7.3 12.53,8.27 12.54,8.26 RN7.2 13.41,8.27 | 13.41,8.27 13.43,8.26 | RN2.3 RN2.4 | RN2.3 54.85,8.27 54.86,8.26 | RN1.1 65.92,8.27 65.91,8.26 65.9,8.27 RN1.2 RN1.3 | RN1.3 64.91,8.27 64.9,8.26
  Bottom 0.254: R66.2 84.45,22.73 83.31,21.59 76.07,21.59 71.88,17.4 71.88,6.86 71.37,6.35 J11.31 | v29.72,17.65 27.69,17.65 26.54,18.8 C34.1 | v38.61,16.26 37.85,16.26 37.72,16.13 37.72,14.99
  Bottom 1.778: SW1.6 SW1.5 | SW2.8 19.75,10.13 J13.7
+5V/1  (via drill 0.4)
  hide 0.406: J1.2 38.1,78.99 38.73,79.63 60.89,79.64 69.47,79.64 70.18,78.93 v70.18,76.18 | 101.88,43.97 102.19,44.28 102.19,53.71 104.06,55.58 104.06,57.34 100.64,60.77 v100.64,62.7 | v70.62,62.76 82.03,62.76 v82.05,62.78
  hide 0.813: U16.4 90.94,47.61 91.31,47.24 | 94.11,46.35 93.22,47.25 C41.1 91.31,47.24 | 94.11,46.35 94.11,44.2 | 94.11,46.35 94.11,44.07 94.61,43.56 101.47,43.56 101.88,43.97 104.9,46.99 109.22,46.99 | 91.31,47.24 91.44,47.12
  hide 1.27: 109.22,46.99 109.22,1.27 99.57,1.27 L3.1
  Bottom 0.406: v70.18,76.18 70.18,63.2 v70.62,62.76 | v82.05,62.78 100.55,62.78 v100.64,62.7
+7V
  hide 0.406: 25.02,73.03 25.1,73.03 34.92,73.03 | 34.92,73.03 36.7,73.03 | 36.7,73.03 U10.6 | 36.7,73.03 C65.1 | 34.92,73.03 R15.1
  hide 1.27: 19.05,78.23 22.35,78.23 23.16,77.42 25.1,77.42 | C59.+ 25.15,77.47 25.1,77.42 | 25.1,77.42 25.1,73.03 L8.P$2
+10V  (via drill 0.38, 0.4)
  hide 0.152: 19.18,59.69 19.09,59.6 | D2.A 24.77,59.69 24.89,59.82 | U7.14 26.67,32.77 26.92,33.02 C10.2 | C8.2 26.92,46.23 26.67,45.97 U6.14 26.67,41.91 26.16,41.66 | 19.05,41.66 U6.17 | U5.14 24.13,59.69 v22.86,58.42
  hide 0.61: C25.2 19.18,59.69 19.05,59.69 U5.17 | C55.2 19.18,33.02 19.05,32.89 U7.17 | C54.2 19.05,46.23 U6.17
  hide 0.813: R51.1 41.7,63.22 41.8,63.22
  hide 1.016: U10.8 39.06,69.2 v40.93,69.2 41.32,68.81 44.4,68.81 45.16,68.05 45.16,66.4 47.97,63.59 | 47.97,63.59 48.09,63.47 | 45.95,63.22 45.95,63.59 47.97,63.59
  hide 1.27: U7.14 26.67,29.46 25.4,28.19 19.05,28.19 | 26.67,42.16 26.16,41.66 19.05,41.66 9.65,41.66 | 26.16,54.86 26.67,55.37 U5.14 | 9.65,41.66 9.65,51.05 11.94,53.34 15.75,53.34 17.27,54.86 26.16,54.86 | 26.16,54.86 18.8,54.86 19.05,55.12 | 19.05,28.19 9.65,28.19 9.65,41.66 | 19.05,28.19 U7.17 | U5.14 26.67,58.12 D2.A | U5.14 26.67,59.69 C9.2
  hide 1.778: 46.97,63.22 45.95,63.22 | 46.97,63.22 63.6,63.22 | 46.97,63.22 41.8,63.22 32.91,63.22 30.93,61.24 C9.2 | C44.+ 63.39,63.22 63.6,63.22 | U$10.P$5 U$10.P$6 64.22,63.22 63.6,63.22
  Bottom 0.152: v22.86,58.42 22.86,59.69 19.05,59.69 U5.17
  Bottom 1.016: v40.93,69.2 42.1,69.2 C66.1
/RD  (via drill 0.4)
  hide 0.152: U4.39 51.57,48 52.83,46.74 57.15,46.74 58.42,48.01 58.42,49.02 58.93,49.53 61.72,49.53 63.13,48.13 U2.34 65.67,48.13 65.91,47.88 70.36,47.88 v70.61,48.13 | U8.22 66.93,21.46 66.04,22.35 v66.04,23.11
  Bottom 0.152: v66.04,23.11 66.55,23.62 67.56,23.62 73.41,29.46 73.41,35.31 73.91,35.81 76.2,35.81 76.45,36.07 76.45,36.96 75.44,37.97 74.04,37.97 73.41,38.61 73.41,40.64 72.39,41.66 72.39,44.58 71.88,45.09 71.88,47.12 70.87,48.13 v70.61,48.13
/WR  (via drill 0.4)
  hide 0.152: U4.38 52.07,48.26 53.09,47.24 56.9,47.24 57.91,48.26 57.91,49.02 58.93,50.04 61.98,50.04 63.09,48.93 U2.33 65.63,48.93 66.17,48.39 69.34,48.39 v69.85,48.9 | U8.27 73.28,25.02 75.18,26.92 75.18,30.99 v74.93,31.24
  Bottom 0.152: v74.93,31.24 73.91,32.26 73.91,34.8 74.42,35.31 76.58,35.31 76.83,35.56 76.83,37.34 75.69,38.48 74.42,38.48 73.91,38.99 73.91,40.89 72.9,41.91 72.9,44.83 72.39,45.34 72.39,47.5 70.99,48.9 v69.85,48.9
A0  (via drill 0.4)
  hide 0.152: U8.21 65.66,21.34 64.64,22.35 58.42,22.35 v56.13,24.64 | U4.28 57.07,51.74 57.4,52.07 61.72,52.07 v61.98,51.82
  Bottom 0.152: v61.98,51.82 61.98,48.26 58.93,45.21 58.93,31.5 57.91,30.48 57.91,27.43 56.13,25.65 v56.13,24.64
A1  (via drill 0.4)
  hide 0.152: U8.23 68.2,23.75 68.07,23.88 64.9,23.88 63.88,22.86 58.93,22.86 v57.15,24.64 | U4.30 56.07,51.37 57.28,52.58 62.48,52.58 62.74,52.32 v62.74,51.05
  Bottom 0.152: v62.74,51.05 62.74,48.01 59.44,44.7 59.44,31.24 58.42,30.23 58.42,26.92 57.15,25.65 v57.15,24.64
A2  (via drill 0.4)
  hide 0.152: U8.24 69.47,23.88 68.96,24.38 64.77,24.38 63.75,23.37 59.44,23.37 v58.17,24.64 | U4.32 55.07,51.39 55.37,51.69 55.63,51.69 57.02,53.09 62.74,53.09 63.5,52.32 v63.5,50.29
  Bottom 0.152: v63.5,50.29 63.75,50.04 63.75,46.48 59.94,42.67 59.94,30.99 58.93,29.97 58.93,26.67 58.17,25.91 v58.17,24.64
A3  (via drill 0.4)
  hide 0.152: U8.25 70.74,24.51 70.36,24.89 64.64,24.89 63.63,23.88 59.94,23.88 v59.18,24.64 | U4.34 54.07,51.4 54.86,52.2 55.37,52.2 56.77,53.59 62.99,53.59 64.26,52.32 v64.26,51.18
  Bottom 0.152: v64.26,51.18 64.26,46.23 60.45,42.42 60.45,30.73 59.44,29.72 59.44,24.89 v59.18,24.64
A4
  hide 0.152: U8.26 72.01,25.02 71.63,25.4 64.52,25.4 63.5,24.38 60.71,24.38 59.69,25.4 54.61,25.4 52.83,27.18 50.55,27.18 49.02,28.7 47.24,28.7 45.72,30.23 45.72,32.51 44.45,33.78 44.45,36.96 U4.75
A5
  hide 0.152: U4.74 45.38,37.43 45.59,37.21 45.59,36.7 44.96,36.07 44.96,33.91 46.23,32.64 46.23,30.61 47.5,29.34 49.15,29.34 50.8,27.69 53.09,27.69 54.86,25.91 59.94,25.91 60.96,24.89 63.37,24.89 64.39,25.91 71.63,25.91 74.55,28.83 74.55,29.34 74.42,29.46 74.5,29.54 U8.1
A6
  hide 0.152: U4.72 46.16,38.43 47.12,37.47 47.12,36.58 46.99,36.45 45.85,36.45 45.47,36.07 45.47,34.04 46.74,32.77 46.74,31.11 47.88,29.97 49.28,29.97 51.05,28.19 53.34,28.19 55.12,26.42 60.2,26.42 61.21,25.4 63.25,25.4 64.26,26.42 71.37,26.42 73.28,28.32 73.28,29.59 | 73.28,29.59 U8.2 | 73.28,29.59 73.41,29.72
A7  (via drill 0.4)
  hide 0.152: U4.71 46.42,38.93 47.88,37.47 v47.88,36.83 | U8.3 71.96,29.54 71.88,29.46 72.01,29.34 72.01,27.81 71.12,26.92 64.14,26.92 63.12,25.91 61.47,25.91 60.45,26.92 55.37,26.92 53.59,28.7 51.31,28.7 49.4,30.61 48.13,30.61 47.12,31.62 47.12,33.53 v46.86,33.78
  Bottom 0.152: v47.88,36.83 47.88,34.8 v46.86,33.78
A8  (via drill 0.4)
  hide 0.152: U4.23 62.31,47.93 62.91,47.33 U2.35 65.96,47.33 v66.17,47.12 | U8.4 70.74,29.84 70.61,29.97 70.61,30.99 70.36,31.24 v66.8,31.24
  Bottom 0.152: v66.17,47.12 66.17,46.1 64.64,44.58 64.64,41.4 65.15,40.89 66.04,40.89 69.34,37.59 69.34,33.78 v66.8,31.24
A9  (via drill 0.4)
  hide 0.152: U4.22 62.05,47.43 62.95,46.53 U2.36 65.49,46.53 65.79,46.23 67.56,46.23 67.82,46.48 68.71,46.48 v69.47,45.72 | v69.85,27.69 69.6,27.94 69.6,29.46 69.52,29.54 U8.5
  Bottom 0.152: v69.85,27.69 72.39,30.23 72.39,39.88 69.85,42.42 69.85,45.34 v69.47,45.72
A10  (via drill 0.4)
  hide 0.152: U4.21 61.79,46.93 62.99,45.72 63,45.73 U2.37 v68.32,45.73 v68.33,45.72 | U8.6 68.33,29.21 v68.33,27.69
  Bottom 0.152: v68.33,45.72 69.34,44.7 69.34,42.16 71.88,39.62 71.88,31.24 v68.33,27.69
A11  (via drill 0.4)
  hide 0.152: U2.38 U4.17 | U2.38 64.74,44.93 64.77,44.96 | U2.38 67.28,44.93 v67.31,44.96 | U8.7 67,29.46 67.06,29.46 v67.06,27.69
  Bottom 0.152: v67.31,44.96 68.33,44.96 68.83,44.45 68.83,41.91 71.37,39.37 71.37,31.75 67.31,27.69 v67.06,27.69
A12  (via drill 0.4)
  hide 0.152: U4.16 62.51,44.43 62.81,44.13 U2.39 65.46,44.13 65.53,44.2 67.82,44.2 v68.07,43.94 | U8.8 65.71,29.54 65.79,29.46 v65.79,27.69
  Bottom 0.152: v68.07,43.94 68.33,43.69 68.33,41.66 70.87,39.12 70.87,32 67.56,28.7 66.8,28.7 v65.79,27.69
A13  (via drill 0.4)
  hide 0.152: U4.15 59.69,43.94 62.23,43.94 62.85,43.33 U2.40 65.93,43.33 v66.04,43.43 | U8.9 64.34,29.54 64.26,29.46 64.52,29.21 v64.52,27.69
  Bottom 0.152: v66.04,43.43 67.31,43.43 67.82,42.93 67.82,41.4 70.36,38.86 70.36,32.26 67.31,29.21 66.04,29.21 v64.52,27.69
A14  (via drill 0.4)
  hide 0.152: U4.14 61.98,43.43 62.88,42.53 U2.41 66.95,42.53 v67.06,42.42 | U8.10 63.17,29.54 63.25,29.46 v63.25,27.69
  Bottom 0.152: v67.06,42.42 67.31,42.16 67.31,41.15 69.85,38.61 69.85,32.51 67.06,29.72 65.79,29.72 64.52,28.45 64.01,28.45 v63.25,27.69
A15
  hide 0.152: U2.42 62.92,41.73 61.72,42.93 U4.13
ADC1_CS  (via drill 0.4)
  hide 0.152: v99.57,38.35 100.97,38.35 101.98,37.34 101.98,33.66 v101.47,33.15 | U18.10 54.86,17.53 56.01,16.38 63.63,16.38 65.28,14.73 68.45,14.73 69.6,13.59 70.36,13.59 70.74,13.21 70.74,10.41 71.12,10.03 93.09,10.03 93.34,10.29 93.34,12.32 92.46,13.21 v91.82,13.21 | U2.10 81.86,44.13 82.86,43.12 84.64,43.12 v84.71,43.05
  Bottom 0.152: v101.47,33.15 104.65,33.15 105.28,32.51 105.28,25.15 98.3,18.16 98.3,16.26 95.25,13.21 v91.82,13.21 | v99.57,38.35 99.57,38.48 96.65,41.4 91.31,41.4 89.92,42.8 84.96,42.8 v84.71,43.05
ADC2_CS  (via drill 0.4)
  hide 0.152: U2.61 75.99,36.28 v75.69,36.58 | v65.02,22.99 65.02,22.61 66.29,21.34 66.29,17.53 66.04,17.27 57.53,17.27 57.28,17.53 57.28,21.59 53.21,25.65 50.8,25.65 50.55,25.91 48.39,25.91 44.7,29.59 44.7,31.62 43.56,32.77 43.05,32.77 42.55,32.26 42.55,23.75 44.07,22.23 U19.10
  Bottom 0.152: v75.69,36.58 75.44,36.32 73.53,36.32 72.9,35.69 72.9,29.72 67.31,24.13 65.66,24.13 65.02,23.5 v65.02,22.99
ADC_BAT  (via drill 0.4)
  hide 0.152: v40.64,52.96 40.64,53.21 40.89,53.47 40.89,57.57 | R51.2 40.01,57.53 40.04,57.57 40.89,57.57 | 40.89,57.57 R55.1
  Bottom 0.152: U11.8 43.12,30.67 42.16,31.62 42.16,43.18 42.67,43.69 42.67,49.78 40.64,51.82 v40.64,52.96
ADC_FROB  (via drill 0.4)
  hide 0.152: U2.60 75.19,36.06 74.93,36.32 74.93,37.08 75.18,37.34 76.45,37.34 77.22,36.58 v78.36,36.58 | v89.15,33.15 v100.33,33.15 | VR1.2B VR1.2A
  Bottom 0.152: v78.36,36.58 82.17,36.58 82.3,36.45 82.3,32 83.82,30.48 87.38,30.48 88.77,31.88 88.77,32.77 v89.15,33.15 | VR1.2B 101.45,34.27 v100.33,33.15
ALE  (via drill 0.4)
  hide 0.152: 57.78,51.69 57.58,51.48 | U4.27 57.57,51.47 57.78,51.69 | 57.78,51.69 61.09,51.69 63.25,49.53 63.88,49.53 64.52,50.16 v65.02,50.16 | U2.43 65.31,40.93 v66.04,41.66
  Bottom 0.152: v66.04,41.66 66.04,41.91 65.28,42.67 65.28,44.07 68.07,46.86 68.07,47.37 65.28,50.16 v65.02,50.16
BATTERY_DATASENSOR  (via drill 1.5)
  hide 1.778: U$11.P$1 97.68,72.37 v102.86,77.55
BATTERY_POWER  (via drill 1.5)
  Bottom 1.778: U$16.P$2 98.09,77.56 v97.67,77.56
CCLK  (via drill 0.4)
  hide 0.152: R47.1 41.66,56.13 v43.43,57.91 | U2.17 78.39,52.29 v78.11,52.58
  Bottom 0.152: v43.43,57.91 43.69,58.17 44.96,58.17 45.72,57.4 45.72,56.9 47.37,55.24 54.36,55.24 55.5,54.1 64.77,54.1 68.33,50.55 77.72,50.55 78.11,50.93 v78.11,52.58
D0
  hide 0.152: U4.1 60.86,36.93 64.52,33.27 | U2.51 67.99,33.7 67.31,33.02 64.77,33.02 64.52,33.27 | U8.11 61.85,30.61 64.52,33.27
D1  (via drill 0.4)
  hide 0.152: U4.2 61.13,37.43 64.26,34.29 | U2.50 67.19,33.92 66.8,33.53 65.02,33.53 64.26,34.29 | U8.12 60.58,30.61 v63.25,33.27 | v65.02,35.05 64.26,34.29
  Bottom 0.152: v63.25,33.27 v65.02,35.05
D2  (via drill 0.4)
  hide 0.152: U4.4 60.89,38.43 63.5,35.81 v64.01,35.81 65.53,35.81 65.79,35.56 66.29,35.56 66.29,34.8 66.39,34.89 U2.49 66.39,35.21 66.29,35.31 | U8.13 59.31,30.61 62.23,33.53 v62.23,34.04
  Bottom 0.152: v62.23,34.04 v64.01,35.81
D3  (via drill 0.4)
  hide 0.152: U4.5 61.15,38.93 63.15,36.93 | 63.15,36.93 U2.48 | 63.15,36.93 65.69,36.93 v66.04,36.58 | U8.15 58.04,19.94 57.91,20.07 57.91,21.46 v58.04,21.59
  Bottom 0.152: v66.04,36.58 66.04,34.8 62.74,31.5 61.98,31.5 59.94,29.46 59.94,23.62 58.04,21.72 v58.04,21.59
D4  (via drill 0.4)
  hide 0.152: U4.8 60.67,40.43 63.37,37.73 | 63.37,37.73 U2.47 | U8.16 59.36,19.74 59.44,19.81 59.18,20.07 v59.18,21.59 | 63.37,37.73 65.92,37.73 v66.04,37.85
  Bottom 0.152: v66.04,37.85 66.8,37.08 66.8,35.81 66.55,35.56 66.55,34.54 62.99,30.99 62.23,30.99 60.45,29.21 60.45,22.86 v59.18,21.59
D5  (via drill 0.4)
  hide 0.152: U4.9 60.93,40.93 63.25,38.61 | U2.46 64.34,38.53 64.26,38.61 63.25,38.61 | 63.25,38.61 66.29,38.61 v67.06,37.85 | U8.17 60.53,19.74 60.45,19.81 v60.45,21.59
  Bottom 0.152: v67.06,37.85 67.31,37.59 67.31,34.54 63.25,30.48 62.48,30.48 60.96,28.96 60.96,22.1 v60.45,21.59
D6  (via drill 0.4)
  hide 0.152: U4.11 59.93,41.93 59.94,41.91 60.71,41.91 63.25,39.37 | U2.45 64.31,39.33 64.26,39.37 63.25,39.37 | v66.04,39.37 63.25,39.37 | v61.72,21.59 61.72,20.32 61.85,20.19 U8.18
  Bottom 0.152: v66.04,39.37 66.8,39.37 67.82,38.35 67.82,34.29 63.5,29.97 62.74,29.97 61.47,28.7 61.47,21.84 v61.72,21.59
D7  (via drill 0.4)
  hide 0.152: U4.12 59.68,42.43 59.69,42.42 60.96,42.42 63.25,40.13 | U2.44 64.27,40.13 64.26,40.13 63.25,40.13 | 63.25,40.13 66.8,40.13 68.83,38.1 68.83,37.59 v68.58,37.34 | U8.19 63.07,19.74 62.99,19.81 v62.99,21.59
  Bottom 0.152: v68.58,37.34 68.58,34.29 63.75,29.46 62.99,29.46 61.98,28.45 61.98,22.61 v62.99,21.59
DATA0  (via drill 0.4)
  hide 0.152: U4.48 47.07,49.48 46.86,49.28 45.97,49.28 45.47,49.78 45.47,51.56 43.43,53.59 43.05,53.59 42.55,54.1 42.55,54.99 v44.45,56.9 | U2.15 78.48,48.13 76.96,46.61 72.01,46.61 71.12,45.72 v71.12,44.07
  Bottom 0.152: v44.45,56.9 47.12,54.23 53.85,54.23 54.99,53.09 64.26,53.09 67.06,50.29 67.06,49.91 70.87,46.1 70.87,44.32 v71.12,44.07
DIGIN0  (via drill 0.4)
  hide 0.152: U4.80 48.07,32.19 48.51,31.75 50.8,31.75 51.69,30.86 v51.69,30.1 | v82.8,27.18 82.8,28.45 81.49,29.76 U13.5
  Bottom 0.152: v51.69,30.1 51.82,29.97 51.82,21.34 55.88,17.27 68.07,17.27 75.69,24.89 80.77,24.89 82.8,26.92 v82.8,27.18
DIGIN1  (via drill 0.4)
  hide 0.152: U4.81 48.57,32.46 48.77,32.26 51.05,32.26 52.83,30.48 v52.83,30.1 | v82.04,27.94 82.04,28.45 80.84,29.65 U13.6
  Bottom 0.152: v52.83,30.1 52.83,27.69 52.32,27.18 52.32,21.59 56.13,17.78 67.82,17.78 75.44,25.4 80.52,25.4 82.04,26.92 v82.04,27.94
DIGIN2  (via drill 0.4)
  hide 0.152: U4.85 50.57,33 50.8,32.77 51.31,32.77 v53.98,30.1 | v81.28,27.18 81.28,28.45 80.19,29.54 U13.7
  Bottom 0.152: v53.98,30.1 53.98,28.07 52.83,26.92 52.83,21.84 56.39,18.29 67.56,18.29 75.18,25.91 80.26,25.91 81.28,26.92 v81.28,27.18
DIGIN3  (via drill 0.4)
  hide 0.152: U4.86 51.07,33.51 51.31,33.27 51.56,33.27 53.34,31.5 53.85,31.5 54.86,30.48 54.86,29.97 55.12,29.72 v55.12,29.21 | U13.8 79.54,29.42 80.52,28.45 v80.52,27.94
  Bottom 0.152: v55.12,29.21 55.37,28.96 55.37,28.7 53.34,26.67 53.34,22.1 56.64,18.8 67.31,18.8 74.93,26.42 80.01,26.42 80.52,26.92 v80.52,27.94
DIGIN4  (via drill 0.4)
  hide 0.152: U4.91 53.57,34.19 55.63,32.13 v55.63,30.35 | v79.76,27.18 79.76,28.45 78.89,29.31 U13.9
  Bottom 0.152: v55.63,30.35 55.88,30.1 55.88,28.45 53.85,26.42 53.85,22.35 56.9,19.3 67.06,19.3 74.68,26.92 79.5,26.92 v79.76,27.18
DIGIN5  (via drill 0.4)
  hide 0.152: U4.92 54.07,34.45 56.39,32.13 v56.39,31.5 | v78.99,27.94 78.99,28.45 78.23,29.21 78.23,30.23 78.24,30.24 U13.10
  Bottom 0.152: v56.39,31.5 56.39,28.19 54.36,26.16 54.36,22.61 57.15,19.81 66.8,19.81 74.42,27.43 78.49,27.43 v78.99,27.94
DIGIN6  (via drill 0.4)
  hide 0.152: U4.96 56.07,34.1 57.4,32.77 v57.66,32.77 | v77.98,28.19 77.98,28.7 77.59,29.09 U13.11
  Bottom 0.152: v57.66,32.77 57.66,31.75 56.9,30.99 56.9,27.94 54.86,25.91 54.86,22.86 57.4,20.32 66.55,20.32 74.17,27.94 77.72,27.94 v77.98,28.19
DIGIN7  (via drill 0.4)
  hide 0.152: U4.97 56.57,34.36 57.15,33.78 v58.17,33.78 | U13.12 76.94,30.25 76.96,30.23 v76.96,28.7
  Bottom 0.152: v58.17,33.78 58.17,33.53 58.42,33.27 58.42,31.75 57.4,30.73 57.4,27.69 55.37,25.65 55.37,23.11 57.66,20.83 66.29,20.83 73.91,28.45 76.71,28.45 v76.96,28.7
DONE  (via drill 0.4)
  hide 0.152: R48.1 43.43,49.02 | U4.51 43.53,48.93 43.43,49.02 | 43.43,49.02 43.43,51.05 43.18,51.31 42.8,51.31 42.55,51.56 42.55,53.34 42.16,53.72 42.16,55.63 v43.43,56.9 | U2.18 77.59,49.79 v77.09,49.28
  Bottom 0.152: v43.43,56.9 44.2,57.66 44.83,57.66 45.21,57.28 45.21,56.77 47.24,54.74 54.1,54.74 55.24,53.59 64.52,53.59 68.07,50.04 76.96,50.04 77.09,49.91 v77.09,49.28
E  (via drill 0.4)
  hide 0.152: U2.31 67.19,51.68 63.63,55.24 v63.63,57.02
  Bottom 0.152: J1.6 48.26,77.34 48.64,76.96 61.72,76.96 63.75,74.93 63.75,57.15 v63.63,57.02
ENCODER0  (via drill 0.4)
  hide 0.152: U4.87 51.57,34.28 v53.59,32.26 | U9.13 33.34,16.45 v33.27,16.38
  Bottom 0.152: v53.59,32.26 51.18,32.26 50.16,31.24 46.48,31.24 46.23,30.99 46.23,19.81 45.21,18.8 40.77,18.8 39.5,17.53 33.53,17.53 33.27,17.27 v33.27,16.38
ENCODER1  (via drill 0.4)
  hide 0.152: U4.88 52.07,34.42 52.32,34.16 52.83,34.16 54.74,32.26 v54.74,31.88 | U9.11 33.36,15.15 v33.27,15.24
  Bottom 0.152: v54.74,31.88 54.36,31.5 51.05,31.5 50.29,30.73 46.99,30.73 46.74,30.48 46.74,19.56 45.47,18.29 41.02,18.29 39.75,17.02 34.16,17.02 34.04,16.89 34.04,16 v33.27,15.24
ENCODER2  (via drill 0.4)
  hide 0.152: U4.90 53.07,36.81 v53.09,36.83 | U9.5 29.54,15.8 v29.72,15.62
  Bottom 0.152: v53.09,36.83 53.09,35.05 50.04,32 46.23,32 45.72,31.5 45.72,20.07 44.96,19.3 40.51,19.3 39.24,18.03 31.5,18.03 30.99,17.53 30.99,16 30.61,15.62 v29.72,15.62
ENCODER3  (via drill 0.4)
  hide 0.152: U4.89 52.57,36.33 v51.82,37.08 | U9.4 29.54,16.45 v29.72,16.64
  Bottom 0.152: v51.82,37.08 51.82,34.8 49.53,32.51 45.97,32.51 45.21,31.75 45.21,20.32 44.7,19.81 40.26,19.81 38.99,18.54 31.37,18.54 30.61,17.78 30.61,16.76 30.48,16.64 v29.72,16.64
FLASH_CS  (via drill 0.4)
  hide 0.152: U2.59 74.39,33.56 v74.68,33.27
  Bottom 0.152: v74.68,33.27 74.68,33.02 76.96,30.73 81.92,30.73 85.09,27.56 89.15,27.56 89.79,26.92 89.79,26.42 89.73,26.36 U15.4
GND  (via drill 0.4, 1.5)
  hide 0.152: U4.10 58.19,41.43 v58.17,41.4 | U4.56 45.66,46.43 v45.97,46.74 | U4.82 49.07,36.66 v48.9,36.83 | U4.3 58.5,37.93 v58.17,37.59 | U4.73 45.89,37.93 46.35,37.47 v46.35,37.21 | v45.97,41.66 45.74,41.43 U4.66 | v58.17,46.48 58.22,46.43 | U8.14 58.04,29.59 58.17,29.72 57.91,29.97 57.91,31.5 55.57,33.84 U4.95 55.57,36.77 v55.63,36.83 56.9,36.83 57.07,36.66 U4.98 | 69.6,34.8 69.59,34.8 U2.53 | U4.29 56.57,49.6 v57.15,49.02 | C15.2 78.49,32.77 78.49,33.27 | 49.02,22.35 v50.04,23.37 | U9.8 27.95,13.85 27.56,13.46 15.33,13.46 v14.7,12.83 | U18.14 49.78,19.56 | v47.62,8.89 C35.2 | 45.02,21.27 C58.2 | C33.2 48.26,22.35 48.01,22.61 | 45.02,22.54 45.09,22.61 44.96,22.73 | S2.P$2 83.52,14.94 v83.44,14.86 | S2.P$1 77.52,14.94 v77.6,14.86 | S3.P$1 88.95,14.94 v89.03,14.86 | v94.87,14.86 94.95,14.94 S3.P$2 95,16.26 95.12,16.38 95.63,16.38 96.01,16.76 | 95.38,31.5 95.37,31.48 U1.18 95.37,31.38 95.38,31.37 95.38,30.1 95.37,30.09 | U1.25 90.82,30.09 90.81,30.1 | 93.47,30.09 93.47,30.1 93.42,30.16 U1.21 | 90.18,30.09 90.17,30.1 90.17,31.24 90.17,31.25 U1.26 | C16.2 97.54,21.34 95.76,23.11 93.09,23.11 92.77,23.44 U1.7 | 97.54,20.45 97.41,20.45 | 84.07,30.35 84.08,30.35 U13.1 | 87.11,32.53 J4.7 | 85.22,28.19 85.22,28.07 | 85.22,28.19 C46.2 | C30.2 85.34,28.07 85.22,28.19 | 85.22,28.32 85.34,28.19 | v43.69,59.69 43.27,59.27 | J16.5 102.03,21.92 102.23,21.72 102.23,21.34 v102.49,21.08 | D15.C 107.28,4.17 v107.23,4.21 107.53,4.21 D16.C | C42.2 8.35,4.67 J13.2 | C24.2 56.58,75.06 U17.2
  hide 0.254: v61.72,45.72 61.02,46.43 U4.20 58.22,46.43 | 69.6,34.8 69.6,33.78 69.85,33.53 73.15,33.53 73.15,32.51 | C15.2 79.5,33.02 80.01,33.53 83.57,33.53 84.09,33 U13.1 84.09,28.81 84.58,28.32 85.22,28.32 | 78.49,32.77 78.49,32.51 77.98,32 76.2,32 75.69,32.51 | U2.63 77.59,33.92 78.23,33.27 78.49,33.27 | v75.69,33.27 75.69,32.51 | 72.14,32.51 C12.2 73.15,32.51 | 75.69,32.51 73.15,32.51 | 48.26,22.35 49.02,22.35 49.28,22.1 49.28,21.46 49.78,20.95 | v69.6,14.99 71.5,14.99 72.07,15.56 C32.2 | 49.78,20.95 U18.14 | 49.78,20.95 49.91,21.08 56.01,21.08 56.13,20.95 U18.9 | 45.02,21.27 45.34,20.95 U19.9 45.34,16.64 45.21,16.51 40.89,16.51 v40.64,16.76 38.99,18.41 U19.14 | 48.01,22.61 45.09,22.61 43.18,24.51 43.18,31.75 v43.31,31.88 | C58.2 45.02,22.54 | 95.37,30.09 93.47,30.09 90.82,30.09 90.18,30.09 | 95.38,30.1 95.38,29.84 95.12,29.59 v95.12,29.08 97.28,29.08 98.17,28.19 98.17,21.97 97.54,21.34 97.54,20.45 | 97.41,20.45 96.01,19.05 96.01,16.76 | 90.17,30.1 89.66,30.1 89.15,29.59 v89.15,29.08 | 87.11,32.53 87.63,32 v87.63,29.08 | 85.34,28.19 C30.2 | VR1.3 100.68,35.78 99.44,34.54 J2.1 97.54,35.56 97.03,36.07 96.39,36.07 | v72.9,59.31 C39.2 | v50.55,49.02 50.57,49.05 U4.41 50.57,51.59 51.05,52.07 51.05,52.96 50.29,53.72 49.02,53.72 48.39,54.36 48.39,55.63 v49.28,56.52 49.75,56.99 Q2.2 | U20.3 94.57,36.49 95,36.07 96.39,36.07 | v72.9,59.31 C40.2 v72.9,59.31 | v55.93,61.28 v72.84,61.38 | C43.2 69.66,4.26 J11.32 | C60.2 96.39,36.96 96.39,36.07
  hide 0.406: U2.22 74.39,53.44 v74.8,53.85 | U12.4 91.35,58.97 | 91.35,58.97 U12.PAD 92.33,60.71 92.54,60.92 U12.8 | 91.35,58.97 91.4,58.97 91.48,58.89
  hide 0.61: C23.2 54.7,69.6 54.7,68.7 55.5,68.7 U3.2
  Bottom 0.152: 102.87,1.27 v107.23,4.21 | 1.27,50.8 v5.84,50.8 | 1.27,29.21 v5.84,29.21 | 1.27,11.43 v3.82,9.93 | v58.17,37.59 58.17,37.34 | 54.61,40.39 C20.2 | 51.12,45.27 51.31,45.47 C21.2 51.25,45.27 51.31,45.21 | 49.53,40.64 C19.2 | 52.58,41.4 52.83,41.15 52.83,40.39 C18.2 | 75.69,32.77 v75.69,33.27 | U11.9 50.42,29.84 51.56,30.99 54.99,30.99 55.63,31.62 v55.63,36.83 | U11.14 49.91,23.5 v50.04,23.37 | C27.2 79.76,33.02 | C45.2 86.23,24.13 85.98,24.38 85.47,24.38 | C34.2 21.84,18.8 20.68,18.86 | 47.62,3.81 v47.62,8.89 | v77.6,14.86 v83.44,14.86 v89.03,14.86 v94.87,14.86 | 109.35,21.08 109.22,21.08 v102.49,21.08 | 109.22,36.83 109.47,36.83 109.43,36.87 VR1.3 | 18.41,17.91 10.52,14.35 9.87,12.83 v14.7,12.83 14.82,12.95 39.75,12.95 40.64,13.84 40.64,14.86 | J4.7 87.11,32.62 | C47.2 90.04,29.08 | 109.22,48.39 109.35,48.39 109.22,48.51 | 94.49,27.81 C4.2 | 40.64,14.86 v40.64,16.76 | 40.64,14.86 C57.2 | C14.2 51.24,58.48 v49.28,56.52 46.1,59.69 v43.69,59.69
  Bottom 0.254: 109.22,36.83 109.18,36.87 | 1.27,29.21 2.29,29.21 | 1.27,11.43 2.29,11.43 | 109.22,60.96 109.2,60.94 | 46.35,38.73 47.24,38.73 48.9,37.08 v48.9,36.83 50.04,36.83 51.05,37.85 53.34,37.85 54.36,36.83 v55.63,36.83 57.91,36.83 58.17,37.08 v58.17,37.59 v58.17,41.4 v58.17,46.48 58.17,48.01 v57.15,49.02 | 46.35,38.73 45.97,39.12 v45.97,41.66 v45.97,46.74 45.97,48.26 46.74,49.02 v50.55,49.02 50.55,46.99 51.25,46.29 C21.2 | 54.61,40.39 C18.2 52.89,41.09 52.58,41.4 | 51.12,45.27 C17.2 | 49.53,40.64 50.29,41.4 52.58,41.4 | C22.2 52.77,43.63 52.58,43.43 | 52.58,43.43 52.58,41.4 | 52.58,43.43 51.31,44.7 51.31,45.21 | 46.35,38.73 v46.35,37.21 46.35,34.92 v43.31,31.88 | 80.01,33.02 79.95,32.96 C27.2 79.76,31.75 | 48.51,23.62 48.39,23.5 U11.14 | v69.6,14.99 69.6,16.76 75.18,22.35 81.41,22.35 83.95,24.89 84.96,24.89 85.47,24.38 86.23,24.38 86.23,21.34 87.25,20.32 96.65,20.32 97.66,21.34 97.66,23.5 97.41,23.75 | 97.41,23.75 U15.7 | 97.41,23.75 97.66,24 97.66,30.48 97.03,31.11 95.63,31.11 95.12,30.61 v95.12,29.08 94.74,29.08 94.49,28.83 94.49,27.81 | C47.2 v89.15,29.08 v87.63,29.08 84.33,29.08 81.66,31.75 79.76,31.75 | v49.28,56.52 49.4,56.39 | 75.69,32.77 76.71,31.75 79.76,31.75 | v74.8,53.85 72.9,55.75 v72.9,59.31 | v72.9,59.31 v72.84,61.38 v72.9,59.31 | C14.2 v55.93,61.28
  Bottom 0.406: v74.8,53.85 73.41,53.85 73.03,53.47 73.03,52.83 73.15,52.7 73.03,52.58 C13.2
  Bottom 1.27: 87.63,80.01 87.62,80 | 35.56,80.01 J1.1 | 40.64,80.01 J1.3 | 45.72,80.01 J1.5